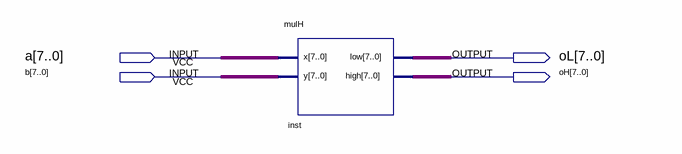
[diagram p0: schematic sheet]
// Quartus schematic 555.bdf as structural Verilog: 1 symbols, 4 pins
module \555  (
  input  [7:0] a,
  input  [7:0] b,
  output [7:0] oL,
  output [7:0] oH
);

  mulH inst (.x(a), .y(b), .low(oL), .high(oH));
endmodule
